# EAGLE design USBasp_B (EAGLE 7.2.0)
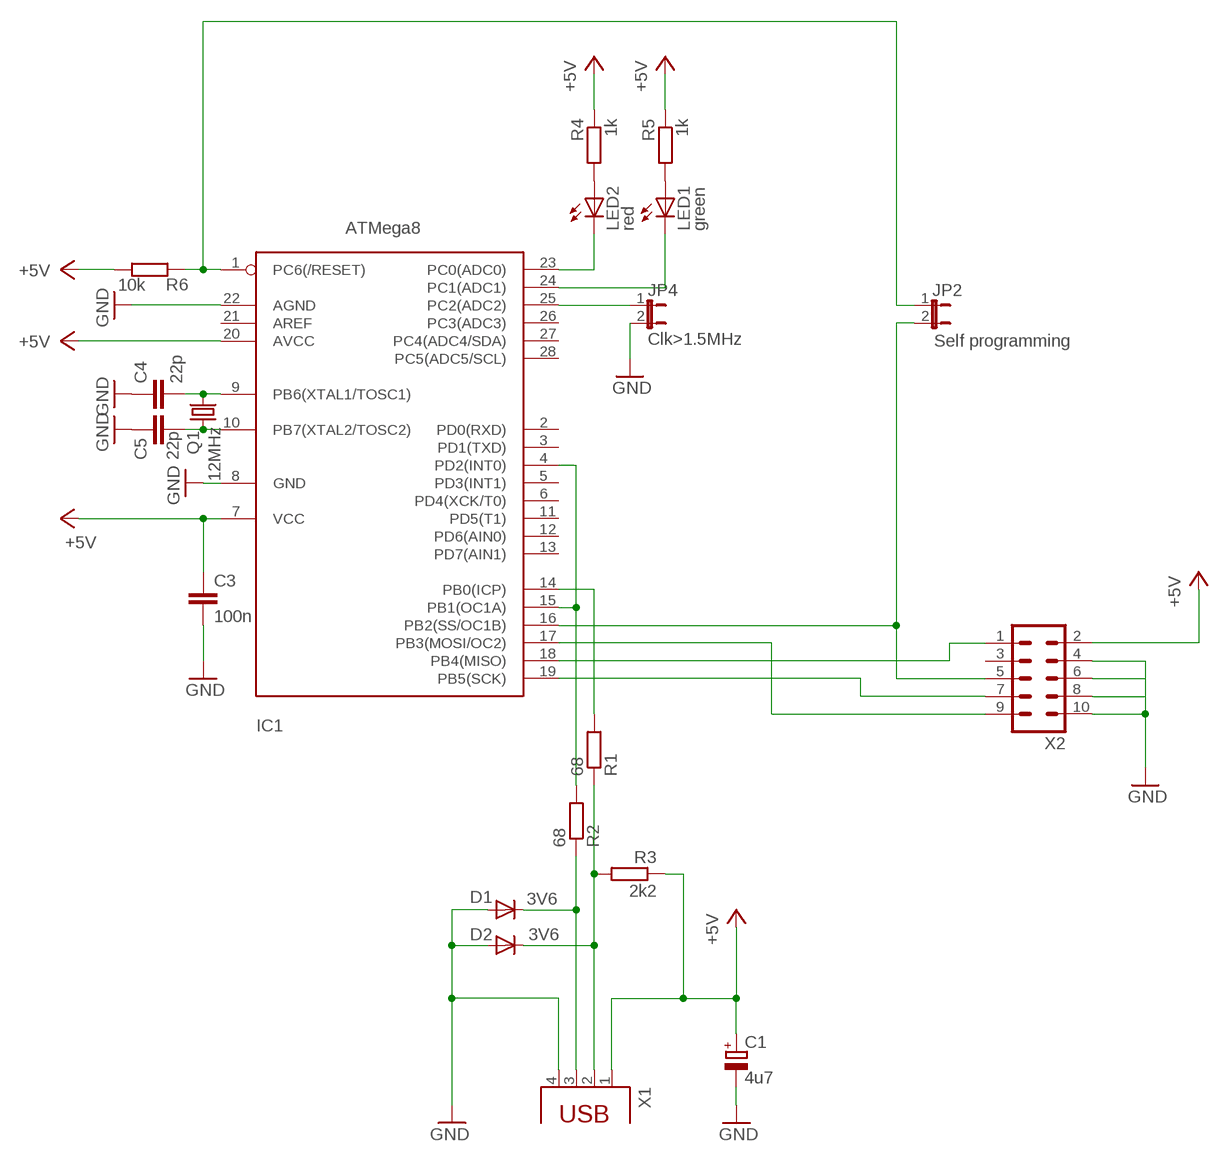
[diagram p0: schematic, sheet 1]

## Parts
C1  4u7  CPOL-EUE2.5-5  [E2,5-5]
C3  100n  C-EUC1206K  [C1206K]
C4  22p  C-EUC1206K  [C1206K]
C5  22p  C-EUC1206K  [C1206K]
D1  3V6  PMLL41SOD80C  [SOD80C]
D2  3V6  PMLL41SOD80C  [SOD80C]
IC1  ATMega8  MEGA8-P  [DIL28-3]
JP2  Self programming  JP1E  [JP1]
JP4  Clk>1.5MHz  JP1E  [JP1]
LED1  green  LED3MM  [LED3MM]
LED2  red  LED3MM  [LED3MM]
Q1  12MHz  CRYTALHC49S  [HC49/S]
R1  68  R-EU_R1206W  [R1206W]
R2  68  R-EU_R1206W  [R1206W]
R3  2k2  R-EU_R1206W  [R1206W]
R4  1k  R-EU_R1206W  [R1206W]
R5  1k  R-EU_R1206W  [R1206W]
R6  10k  R-EU_R1206W  [R1206W]
X1  PN61729  [PN61729]
X2  ML10  [ML10]

## Nets
+5V: C1.+ C3.1 IC1.7(VCC) IC1.20(AVCC) R3.1 R4.1 R5.1 R6.1 X1.1 X2.2
GND: C1.- C3.2 C4.1 C5.1 D1.A D2.A IC1.8(GND) IC1.22(AGND) JP4.2 X1.4 X2.4 X2.6 X2.8 X2.10
N$1: IC1.1(PC6(/RESET)) JP2.1 R6.2
N$2: IC1.16(PB2(SS/OC1B)) JP2.2 X2.5
N$3: IC1.17(PB3(MOSI/OC2)) X2.9
N$4: IC1.19(PB5(SCK)) X2.7
N$5: D2.C R1.1 R3.2 X1.2
N$7: IC1.4(PD2(INT0)) IC1.15(PB1(OC1A)) R2.2
N$8: D1.C R2.1 X1.3
N$13: LED2.A R4.2
N$14: IC1.23(PC0(ADC0)) LED2.K(C)
N$15: IC1.24(PC1(ADC1)) LED1.K(C)
N$16: IC1.14(PB0(ICP)) R1.2
N$22: C4.2 IC1.9(PB6(XTAL1/TOSC1)) Q1.2
N$23: C5.2 IC1.10(PB7(XTAL2/TOSC2)) Q1.1
N$24: IC1.25(PC2(ADC2)) JP4.1
N$25: LED1.A R5.2
N$27: IC1.18(PB4(MISO)) X2.1
Unconnected: IC1.2(PD0(RXD)) IC1.3(PD1(TXD)) IC1.5(PD3(INT1)) IC1.6(PD4(XCK/T0)) IC1.11(PD5(T1)) IC1.12(PD6(AIN0)) IC1.13(PD7(AIN1)) IC1.21(AREF) IC1.26(PC3(ADC3)) IC1.27(PC4(ADC4/SDA)) IC1.28(PC5(ADC5/SCL)) X2.3

## Library data of the parts
C1 = rcl:CPOL-EU: POLARIZED CAPACITOR, European symbol
C3-C5 = rcl:C-EU: CAPACITOR, European symbol
D1 D2 = diode:PMLL41*: High-speed diodes Source: http://www.semiconductors.philips.com/acrobat_download/datasheets/PMLL4150_2.pdf
IC1 = atmel:MEGA8-P: MICROCONTROLLER 8 Kbytes FLASH 1 kbytes SRAM 512 bytes EEPROM USART 4-channel 10 bit ADC 2-channel 8 bit ADC Source: avr.lbr
JP2 JP4 = jumper:JP1E: JUMPER
LED1 LED2 = led:LED: LED OSRAM: - CHIPLED LG R971, LG N971, LY N971, LG Q971, LY Q971, LO R971, LY R971 LH N974, LH R974 LS Q976, LO Q976, LY Q976 LO Q996 - Hyper CHIPLED LW Q18S LB Q993, LB Q99A, LB R99A - SideLED LS A670, LO A670, LY A670, LG A670, LP A670 LB A673, LV A673, LT A673, LW A673 LH A674 LY A675 LS A676, LA A676, LO A676, LY A676, LW A676 LS A679, LY A679, LG A679 - Hyper Micro SIDELED® LS Y876, LA Y876, LO Y876, LY Y876 LT Y87S - SmartLED LW L88C, LW L88S LB L89C, LB L89S, LG L890 LS L89K, LO L89K, LY L89K LS L896, LA L896, LO L896, LY L896 - TOPLED LS T670, LO T670, LY T670, LG T670, LP T670 LSG T670, LSP T670, LSY T670, LOP T670, LYG T670 LG T671, LOG T671, LSG T671 LB T673, LV T673, LT T673, LW T673 LH T674 LS T676, LA T676, LO T676, LY T676, LB T676, LH T676, LSB T676, LW T676 LB T67C, LV T67C, LT T67C, LS T67K, LO T67K, LY T67K, LW E67C LS E67B, LA E67B, LO E67B, LY E67B, LB E67C, LV E67C, LT E67C LW T67C LS T679, LY T679, LG T679 LS T770, LO T770, LY T770, LG T770, LP T770 LB T773, LV T773, LT T773, LW T773 LH T774 LS E675, LA E675, LY E675, LS T675 LS T776, LA T776, LO T776, LY T776, LB T776 LHGB T686 LT T68C, LB T68C - Hyper Mini TOPLED® LB M676 - Mini TOPLED Santana® LG M470 LS M47K, LO M47K, LY M47K Source: http://www.osram.convergy.de/
Q1 = crystal:CRYTAL: CRYSTAL
R1-R6 = rcl:R-EU_: RESISTOR, European symbol
X1 = con-berg:PN61729: BERG USB connector
X2 = con-harting-ml:ML10: HARTING; OC_FARNELL: unknown; OC_NEWARK: unknown

## Board
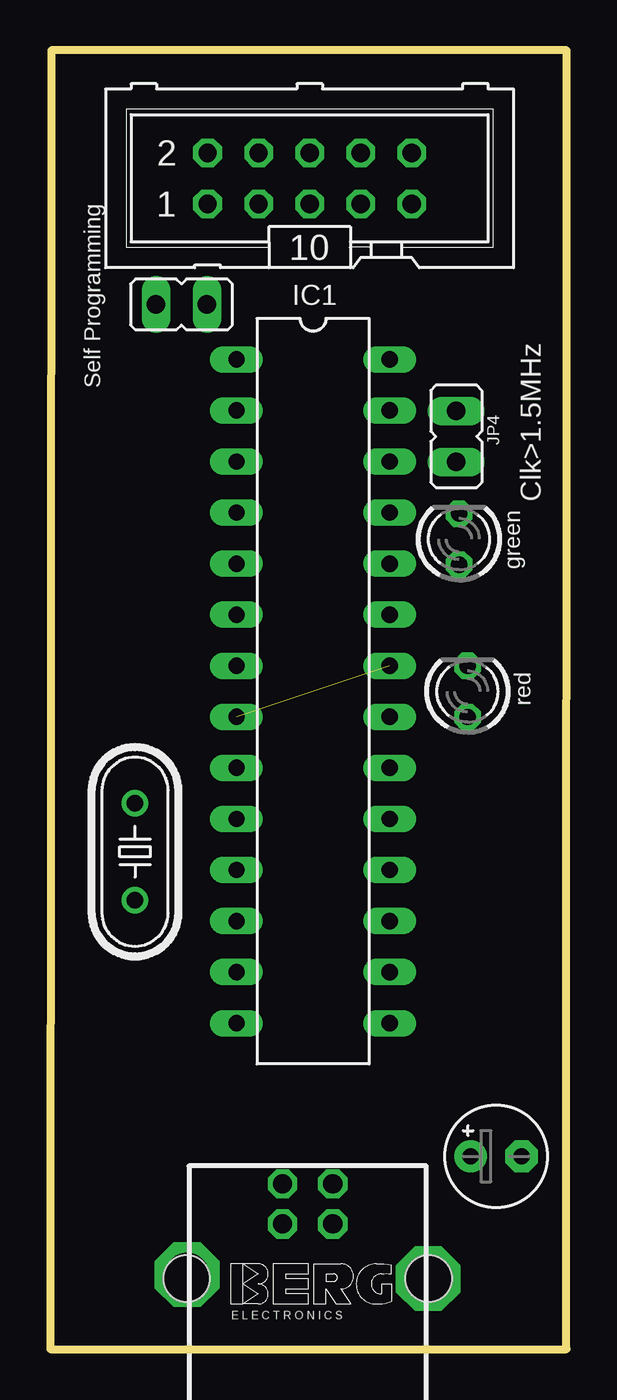
[diagram p1: board, top side]
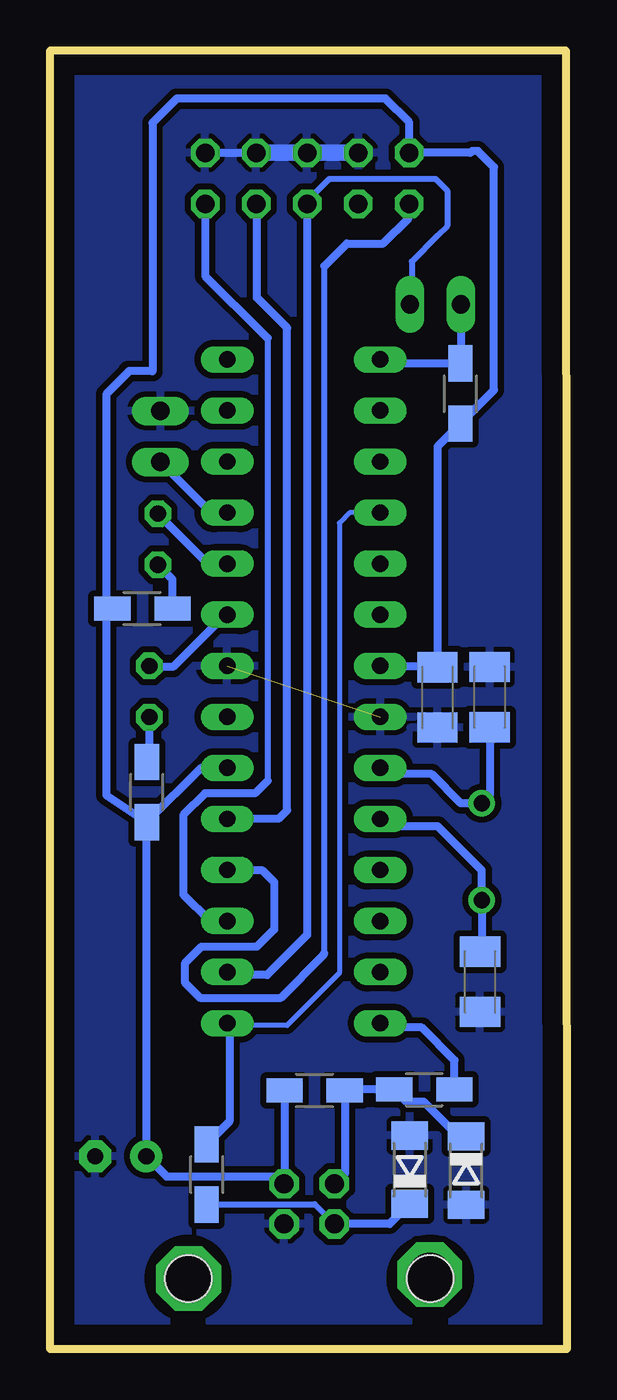
[diagram p2: board, bottom side, seen from below]

Size 25.7 x 64.62 mm. Coordinates in mm from the lower left corner, seen from the top.
Outline: 0.05,64.62 0,0 25.69,0 25.7,64.61 0.05,64.62
Copper layers (1*16): Top 0.035mm / dielectric 1.5mm / Bottom 0.035mm
Design rules "default": minimum track width 10mil, minimum drill 24mil, track to track 8mil, track to pad 8mil, pad to pad 8mil, via to via 8mil, smd to smd 8mil, copper to edge 40mil, drill to drill 8mil, minimum pad ring 10mil, minimum via ring 8mil, stop-mask expansion 4mil, vias tented up to drill 0mil, thermal gap 10mil

### Footprints (pad centres in the part's own frame; a part is rotated, then mirrored left to right if it is on the bottom)
E2,5-5 = drill 0.813 pad 1.6: + -1.27,0 | drill 0.813 pad 1.6 octagon: - 1.27,0
C1206K = smd 1.5 x 2: 1 -1.5,0; 2 1.5,0
SOD80C = smd 1.4 x 1.8: A 1.7,0; C -1.7,0
DIL28-3 = drill 0.813 long: 1 -16.51,-3.81; 2 -13.97,-3.81; 3 -11.43,-3.81; 4 -8.89,-3.81; 5 -6.35,-3.81; 6 -3.81,-3.81; 7 -1.27,-3.81; 8 1.27,-3.81; 9 3.81,-3.81; 10 6.35,-3.81; 11 8.89,-3.81; 12 11.43,-3.81; 13 13.97,-3.81; 14 16.51,-3.81; 15 16.51,3.81; 16 13.97,3.81; 17 11.43,3.81; 18 8.89,3.81; 19 6.35,3.81; 20 3.81,3.81; 21 1.27,3.81; 22 -1.27,3.81; 23 -3.81,3.81; 24 -6.35,3.81; 25 -8.89,3.81; 26 -11.43,3.81; 27 -13.97,3.81; 28 -16.51,3.81
JP1 = drill 0.914 long: 1 0,-1.27; 2 0,1.27
LED3MM = drill 0.813 octagon: A -1.27,0; K 1.27,0
HC49/S = drill 0.813: 1 -2.413,0; 2 2.413,0
R1206W = smd 1.8 x 1.2: 1 -1.499,0; 2 1.499,0
PN61729 = drill 0.95 octagon: 1 1.25,4.71; 2 -1.25,4.71; 3 -1.25,2.71; 4 1.25,2.71 | hole 2.3: -6.02,0; 6.02,0
ML10 = drill 0.914 octagon: 1 -5.08,-1.27; 2 -5.08,1.27; 3 -2.54,-1.27; 4 -2.54,1.27; 5 0,-1.27; 6 0,1.27; 7 2.54,-1.27; 8 2.54,1.27; 9 5.08,-1.27; 10 5.08,1.27

### Placement (x,y rotation side)
C1  22.19,9.6 0 top
C3  6.43,32.43 270 bottom
C4  3.83,32.44 270 bottom
C5  4.31,18.28 90 bottom
D1  7.81,8.93 90 bottom
D2  5,8.89 270 bottom
IC1  13.08,32.73 270 top
JP2  6.53,51.97 270 top
JP4  20.21,45.41 0 top
LED1  20.35,40.3 90 top
LED2  20.77,32.72 90 top
Q1  4.22,24.75 90 top
R1  7.08,12.92 0 bottom
R2  17.91,8.7 90 bottom
R3  12.54,12.88 0 bottom
R4  20.89,27.72 90 bottom
R5  21.11,36.85 0 bottom
R6  5.29,47.54 90 bottom
X1  12.81,3.52 0 top
X2  12.91,58.25 0 top

### Tracks (layer width: path | path; a pad name or v marks a point on that pad's centre or on a via)
+5V
  Bottom 0.406: 22.91,36.81 22.91,47.51 21.81,48.61 21.81,48.65 20.61,48.65 20.61,61.01 19.41,62.21 9.01,62.21 7.83,61.03 X2.2 4.8,59.52 4.71,59.61 4.41,59.61 3.61,58.81 3.61,47.72 R6.1 6.41,44.92 6.41,34 6.61,34 | 22.91,36.81 22.91,27.56 R4.1 | IC1.7 6.61,34 | C3.1 6.54,33.93 6.61,34 | 13.98,12.88 R3.1 14.04,8.25 X1.1 14.43,8.6 19.92,8.6 C1.+ 20.92,25.75 R4.1 | R5.1 22.87,36.85 22.91,36.81 | IC1.20 18.19,28.92 R4.1
GND  (1 unrouted)
  Bottom 0.406: X2.10 X2.8
  Bottom 0.813: X2.4 X2.6 X2.8
  pour Bottom (isolate 0.305): -0.01,64.56 25.61,64.6 25.62,-0.01 0.06,-0.01
N$1
  Bottom 0.305: 9.51,49.48 IC1.1
  Bottom 0.406: IC1.1 9.07,49.04 R6.2 5.26,49.07 JP2.1
N$2
  Bottom 0.305: JP2.2 7.71,52.06 7.71,54.11 6.41,55.41 5.94,55.88 5.94,57.64 6.52,58.22 11.81,58.22 12.91,57.12
  Bottom 0.406: IC1.16 16.74,18.61 14.91,18.61 12.91,20.61 X2.5 12.91,57.12
N$3
  Bottom 0.305: 14.88,50.3 14.88,28.27
  Bottom 0.406: X2.9 17.99,53.39 15.12,50.52 15.1,50.52 14.88,50.3 | 14.88,28.27 15.46,27.69 15.49,27.69 15.53,27.65 18,27.65 19.08,26.57 19.08,22.62 17.78,21.32 16.91,21.32 IC1.17
N$4
  Bottom 0.406: IC1.19 14.34,26.38 13.91,26.81 13.91,50.81 15.41,52.31 15.41,56.94 X2.7
N$5
  Bottom 0.406: X1.2 11.04,8.71 R3.2 11,12.92 R1.1 7.97,12.31 7.11,12.31 5.39,10.59 D2.C
N$7
  Bottom 0.254: IC1.4 10.8,41.62 11.31,41.11 11.31,18.71 13.91,16.11 16.78,16.11 IC1.15
  Bottom 0.406: 16.78,16.11 16.78,11.33 R2.2
N$8
  Bottom 0.305: R2.1 12.54,7.21 X1.3
  Bottom 0.406: D1.C 8.81,6.23 X1.3
N$10  (via drill 2.2 pad 0.81)
  other vias: 18.81,3.51
N$13
  Bottom 0.406: LED2.A 20.77,29.08 R4.2
N$14
  Bottom 0.406: IC1.23 17.08,36.54 17.08,36.46 19.59,33.95 20.73,33.95 LED2.K
N$15
  Bottom 0.406: IC1.24 17.86,39.08 LED1.K
N$16
  Bottom 0.406: R1.2 5.58,14.38 7.21,16.01 9.06,16.01 IC1.14
N$18  (via drill 2.2 pad 0.81)
  other vias: 6.81,3.71
N$22
  Bottom 0.406: IC1.9 8.96,28.61 6.71,28.61 5.26,27.16 Q1.2 3.83,27.55 C4.2
N$23
  Bottom 0.406: C5.2 4.22,19.87 Q1.1 4.22,23.82 6.41,26.01 8.9,26.01 IC1.10
N$24
  Bottom 0.406: IC1.25 17.69,41.62 JP4.1
N$25
  Bottom 0.406: R5.2 19.61,38.29 LED1.A
N$27
  Bottom 0.305: 12.06,19.7 12.06,53.88
  Bottom 0.406: IC1.18 15.16,23.84 14.56,23.24 14.56,20.88 15.42,20.02 18.18,20.02 19.01,19.19 19.01,18.25 18.25,17.49 14.22,17.49 12.09,19.62 12.09,19.67 12.06,19.7 | 12.06,53.88 10.94,55 9.13,55 7.86,56.27 7.86,56.95 X2.1

### Text on the board
tPlace: Self Programming